# Altium project Nixie Valve Clock.PrjPcb (part 1 of 2)
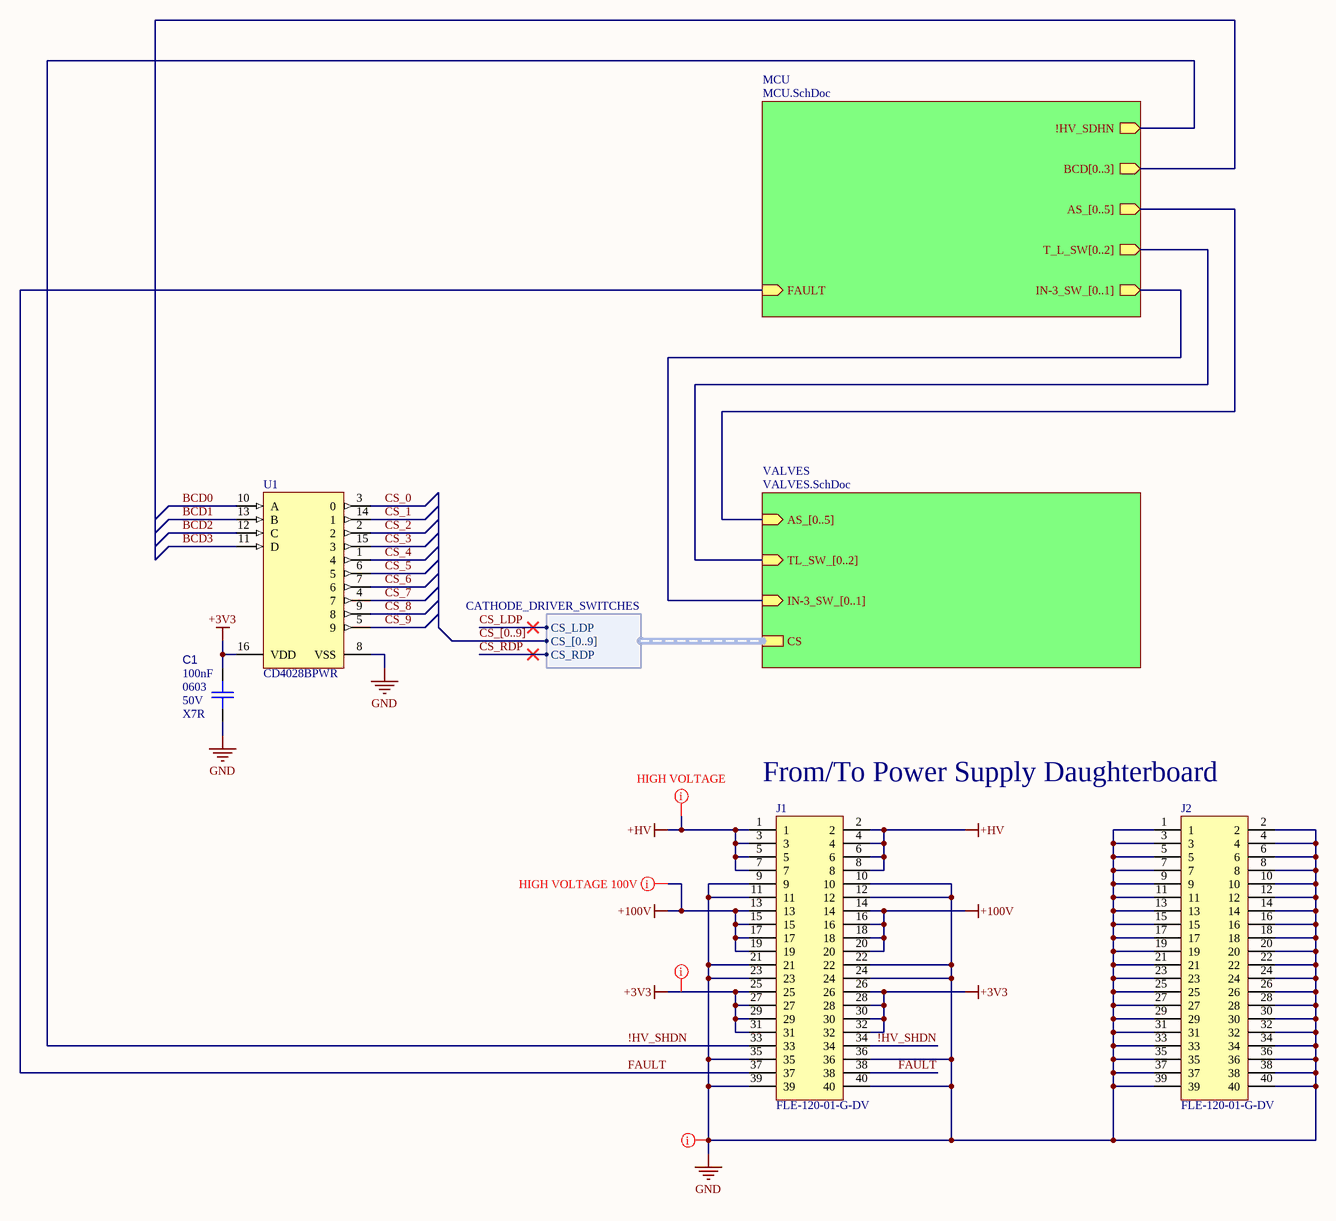
[diagram p0: Nixie Valve Clock.SchDoc]
9 sheets, 163 parts. Net scope: hierarchical (ports join the sheet entries above them; power ports are global).
Board file: Nixie Valve Clock.PcbDoc
Sheets:
  Nixie Valve Clock.SchDoc
    MCU = MCU.SchDoc
    VALVES = VALVES.SchDoc
      IN-14 VALVE ANODE DRIVER0 = IN-14 VALVE ANODE DRIVER.SchDoc
      IN-14 VALVE ANODE DRIVER1 = IN-14 VALVE ANODE DRIVER.SchDoc
      IN-14 VALVE ANODE DRIVER2 = IN-14 VALVE ANODE DRIVER.SchDoc
      IN-14 VALVE ANODE DRIVER3 = IN-14 VALVE ANODE DRIVER.SchDoc
      IN-14 VALVE ANODE DRIVER4 = IN-14 VALVE ANODE DRIVER.SchDoc
      IN-14 VALVE ANODE DRIVER5 = IN-14 VALVE ANODE DRIVER.SchDoc
      IN-14 VALVE CATHODE DRIVER_0 = IN-14 VALVE CATHODE DRIVER.SchDoc
      IN-14 VALVE CATHODE DRIVER_1 = IN-14 VALVE CATHODE DRIVER.SchDoc
      IN-14 VALVE CATHODE DRIVER_2 = IN-14 VALVE CATHODE DRIVER.SchDoc
      IN-14 VALVE CATHODE DRIVER_3 = IN-14 VALVE CATHODE DRIVER.SchDoc
      IN-14 VALVE CATHODE DRIVER_4 = IN-14 VALVE CATHODE DRIVER.SchDoc
      IN-14 VALVE CATHODE DRIVER_5 = IN-14 VALVE CATHODE DRIVER.SchDoc
      IN-14 VALVE CATHODE DRIVER_6 = IN-14 VALVE CATHODE DRIVER.SchDoc
      IN-14 VALVE CATHODE DRIVER_7 = IN-14 VALVE CATHODE DRIVER.SchDoc
      IN-14 VALVE CATHODE DRIVER_8 = IN-14 VALVE CATHODE DRIVER.SchDoc
      IN-14 VALVE CATHODE DRIVER_9 = IN-14 VALVE CATHODE DRIVER.SchDoc
      IN-14_VALVE_x2_0 = IN-14 VALVE x2.SchDoc
        IN-14 VALVE_0 = IN-14 VALVE.SchDoc
        IN-14 VALVE_1 = IN-14 VALVE.SchDoc
      IN-14_VALVE_x2_1 = IN-14 VALVE x2.SchDoc
        IN-14 VALVE_0 = IN-14 VALVE.SchDoc
        IN-14 VALVE_1 = IN-14 VALVE.SchDoc
      IN-14_VALVE_x2_2 = IN-14 VALVE x2.SchDoc
        IN-14 VALVE_0 = IN-14 VALVE.SchDoc
        IN-14 VALVE_1 = IN-14 VALVE.SchDoc
      IN-3 VALVE_0 = IN-3 VALVE.SchDoc
      IN-3 VALVE_1 = IN-3 VALVE.SchDoc
      IN-3 VALVE CATHODE DRIVER0 = IN-3 VALVE CATHODE DRIVER.SchDoc
      IN-3 VALVE CATHODE DRIVER1 = IN-3 VALVE CATHODE DRIVER.SchDoc

## Sheet Nixie Valve Clock.SchDoc
size A3; SheetNumber: 1; SheetTotal: 9

### Parts
(Parts that share a designator on the sheet are numbered #1, #2 ... from top to bottom, then left to right.)
?#1  (no value)
C1  value 100nF  Voltage Rating: 50V  Case/Package: 0603  Dielectric: X7R  [CAPC1608X09N]  (hidden comment: CGA3E2X7R1H104K080AA)
J1  FLE-120-01-G-DV  [FLE-120-01-XX-DV]
J2  FLE-120-01-G-DV  [FLE-120-01-XX-DV]
U1  CD4028BPWR  [PW0016A_N]

### Sub-sheets
MCU = MCU.SchDoc: AS_[0..5] (out), BCD[0..3] (out), T_L_SW[0..2] (out), IN-3_SW_[0..1] (out), !HV_SDHN (out), FAULT (in)
VALVES = VALVES.SchDoc: AS_[0..5] (in), CS (harness CATHODE_DRIVER_SWITCHES), TL_SW_[0..2] (in), IN-3_SW_[0..1] (in)

### Harnesses
CATHODE_DRIVER_SWITCHES: CS_LDP, CS_[0..9], CS_RDP

### Nets
+3V3: C1.1 J1.25 J1.26 J1.27 J1.28 J1.29 J1.30 J1.31 J1.32 U1.16(VDD)
+100V: J1.13 J1.14 J1.15 J1.16 J1.17 J1.18 J1.19 J1.20
+HV: J1.1 J1.2 J1.3 J1.4 J1.5 J1.6 J1.7 J1.8
GND: C1.2 J1.9 J1.10 J1.11 J1.12 J1.21 J1.22 J1.23 J1.24 J1.35 J1.36 J1.39 J1.40 J2.1 J2.2 J2.3 J2.4 J2.5 J2.6 J2.7 J2.8 J2.9 J2.10 J2.11 J2.12 J2.13 J2.14 J2.15 J2.16 J2.17 J2.18 J2.19 J2.20 J2.21 J2.22 J2.23 J2.24 J2.25 J2.26 J2.27 J2.28 J2.29 J2.30 J2.31 J2.32 J2.33 J2.34 J2.35 J2.36 J2.37 J2.38 J2.39 J2.40 U1.8(VSS)
!HV_SHDN: J1.33 J1.34 ; sheet MCU/!HV_SDHN
BCD0: U1.10(A)
BCD1: U1.13(B)
BCD2: U1.12(C)
BCD3: U1.11(D)
CS_0: U1.3(0)
CS_1: U1.14(1)
CS_2: U1.2
CS_3: U1.15(3)
CS_4: U1.1(4)
CS_5: U1.6(5)
CS_6: U1.7(6)
CS_7: U1.4(7)
CS_8: U1.9(8)
CS_9: U1.5(9)
CS_LDP: sheet VALVES/CS.CS_LDP
CS_RDP: sheet VALVES/CS.CS_RDP
FAULT: J1.37 J1.38 ; sheet MCU/FAULT

### Buses and harness runs
bus CS_[0..9]
bus sheet MCU/AS_[0..5] = sheet VALVES/AS_[0..5]
bus sheet MCU/IN-3_SW_[0..1] = sheet VALVES/IN-3_SW_[0..1]
bus sheet MCU/T_L_SW[0..2] = sheet VALVES/TL_SW_[0..2]

### Layout directives
net class HIGH VOLTAGE: +HV
net class HIGH VOLTAGE 100V: +100V
net class POWER: +3V3, GND

### Notes on the sheet
- From/To Power Supply Daughterboard
- Project:
- Designer:
- Sheet
- of
- Filename:

### Library data of the parts
?#1 = CMP-00003-4: The KETS Schematic Sheet Title Block
C1 = CMP-001-00101-1: Ceramic Capacitor, Multilayer, Ceramic, 50V, 10% +Tol, 10% -Tol, X7R, 15% TC, 0.1uF, Surface Mount, 0603; Reference Standard: AEC-Q200; Multilayer: Yes; Tolerance  (fill in as +-): 10%; Mounting Technology: Surface Mount; Max Operating Temperature: 125°C; Min Operating Temperature: -55°C; Tolerance: 10%; Packaging: Tape and Reel; Length: 1.6mm; Package Style: SMTMeter; Width: 0.8mm; Height: 0.8mm; Pins: 2; Reach SVHC Compliant: Yes; RoHS Compliant: Yes; Package Shape: Rectangular; Tolerance (fill in as +-): 10%; Rated DC Voltage (URdc): 50V; JESD-609 Code: e3; Capacitor Type: Ceramic; Termination: Wraparound; Terminal Finish: Nickel; Dielectric Material: Ceramic; Temperature Characteristics Code: X7R
J1 J2 = CMP-073-000000-3: PCB Receptacle, Board-to-Board, Wire-to-Board, 1.27 mm, 2 Rows, 40 Contacts, Surface Mount; Manufacturer Lifecycle Status: PRODUCTION; Pitch: 1.27mm; MF: Samtec; Connector Type: Receptacle, Socket; Number of Contacts: 40; Max Current Rating: 1.75A; Contact Resistance: 15mΩ; Pins: 40; REACH SVHC: No; Price: None; Component Type: Standard; Pin Count: 40; Housing Color: Black; Lead Pitch: 1.27mm; Number of Rows: 2; Max Operating Temperature: 125°C; MP: FLE-120-01-XX-DV; Value: *; Design Item ID: FLE-120-01-XX-DV; Number of Positions: 40; RoHS: Compliant; Lifecycle Status: Production; Source: FLE-120-01-XX-DV.SchLib; Packaging: Bulk; Orientation: Straight; Contact Material: Bronze; Row Spacing: 1.27mm; Housing Material: Polymer; Current Rating: 1.75A; Contact Plating: Gold; Termination: Solder; Length: 25.51mm; Gender: Receptacle; Lead Free: Lead Free; Depth: 3.33mm; Color: Black; Mounting Technology: Surface Mount; Min Operating Temperature: -55°C; Package: None; Radiation Hardening: No; Availability: Unavailable
U1 = CMP-00024-00008-1: CMOS BCD-to-Decimal or Binary-to-Octal Decoders/Drivers 16-TSSOP -55 to 125; Manufacturer Lifecycle Status: ACTIVE; Min Supply Voltage: 3V; Bandwidth: 8MHz; Number of Outputs: 10; Propagation Delay: 160ns; Logic Function: Decoder, Demultiplexer; Number of Elements: 1; Turn-On Delay Time: 350ns; Polarity: Non-Inverting; Max Supply Voltage: 18V; Number of Inputs: 4; Low Level Output Current: 6.8mA; Quiescent Current: 100µA; Supply Type: Dual, Single; Max Operating Temperature: 125°C; Min Operating Temperature: -55°C; Number of Output Lines: 10; Thickness: 1mm; Weight: 61.887009mg; Independent Circuits: 1; Number of Bits: 10; Number of Channels: 1; RoHS Compliant: Yes; Mounting Technology: Surface Mount; Number of Input Lines: 4; Pins: 16; Width: 4.4mm; Lead Free: Lead Free; Case/Package: TSSOP; RoHS: Compliant; Contact Plating: Gold; High Level Output Current: 6.8mA; Length: 5mm; Lifecycle Status: Production; Height: 1.2mm

## Sheet MCU.SchDoc
size A3; SheetNumber: 2; SheetTotal: 9
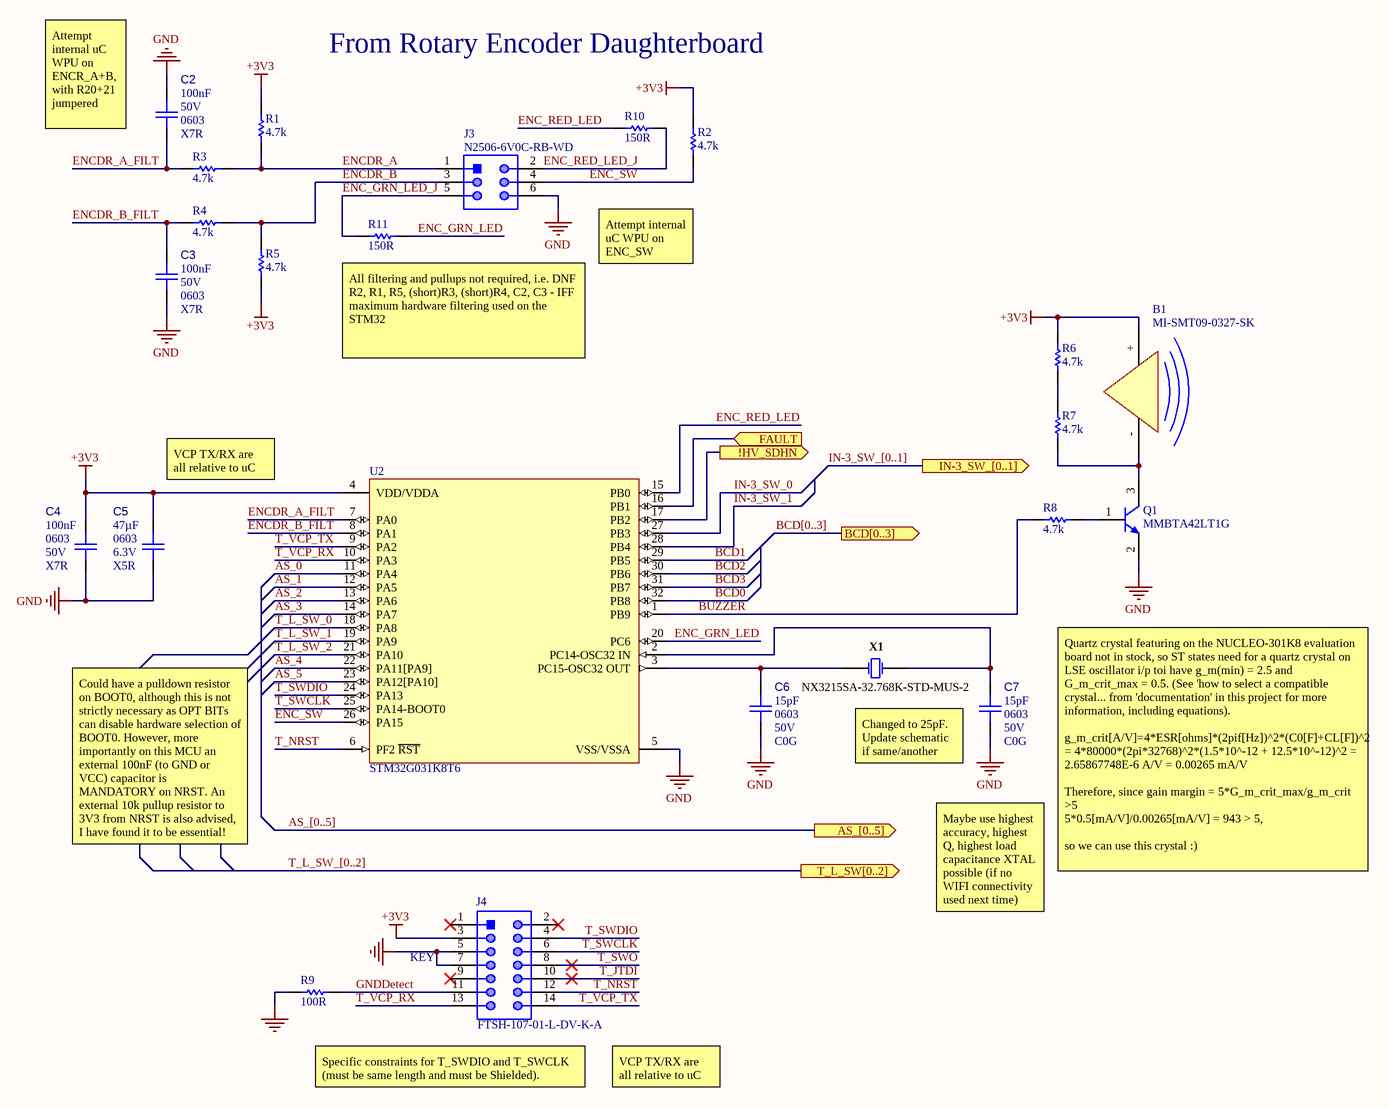
[diagram p1: MCU.SchDoc]

### Parts
(Parts that share a designator on the sheet are numbered #1, #2 ... from top to bottom, then left to right.)
?#2  (no value)
B1  MI-SMT09-0327-SK  [INDP9696X53N]
C2  value 100nF  Voltage Rating: 50V  Case/Package: 0603  Dielectric: X7R  [CAPC1608X09N]  (hidden comment: CGA3E2X7R1H104K080AA)
C3  value 100nF  Voltage Rating: 50V  Case/Package: 0603  Dielectric: X7R  [CAPC1608X09N]  (hidden comment: CGA3E2X7R1H104K080AA)
C4  value 100nF  Voltage Rating: 50V  Case/Package: 0603  Dielectric: X7R  [CAPC1608X09N]  (hidden comment: CGA3E2X7R1H104K080AA)
C5  value 47µF  Dielectric: X5R  Voltage Rating: 6.3V  Case/Package: 0603  [CAPC1608X87X35NL15T15]  (hidden comment: 06036D476MAT2A)
C6  value 15pF  Voltage Rating: 50V  Dielectric: C0G  Case/Package: 0603  [CAPC1608X87X35NL15T15]  (hidden comment: C0603X150J5GACTU)
C7  value 15pF  Voltage Rating: 50V  Dielectric: C0G  Case/Package: 0603  [CAPC1608X87X35NL15T15]  (hidden comment: C0603X150J5GACTU)
J3  N2506-6V0C-RB-WD  [N2506-6V0C-RB-WD-Footprint-1]
J4  FTSH-107-01-L-DV-K-A  [FP-FTSH-107-01-L-DV-K-A-MFG]
Q1  MMBTA42LT1G  [ONSC-SOT-23-3-318-08_V]
R1  value 4.7k  [RESC1608X55X25NL10T15]  (hidden comment: Resistor 4k7 +/-1% 0603 100 mW)
R2  value 4.7k  [RESC1608X55X25NL10T15]  (hidden comment: Resistor 4k7 +/-1% 0603 100 mW)
R3  value 4.7k  [RESC1608X55X25NL10T15]  (hidden comment: Resistor 4k7 +/-1% 0603 100 mW)
R4  value 4.7k  [RESC1608X55X25NL10T15]  (hidden comment: Resistor 4k7 +/-1% 0603 100 mW)
R5  value 4.7k  [RESC1608X55X25NL10T15]  (hidden comment: Resistor 4k7 +/-1% 0603 100 mW)
R6  value 4.7k  [RESC1608X55X25NL10T15]  (hidden comment: Resistor 4k7 +/-1% 0603 100 mW)
R7  value 4.7k  [RESC1608X55X25NL10T15]  (hidden comment: Resistor 4k7 +/-1% 0603 100 mW)
R8  value 4.7k  [RESC1608X55X25NL10T15]  (hidden comment: Resistor 4k7 +/-1% 0603 100 mW)
R9  value 100R  [RESC1608X55X25NL10T15]  (hidden comment: ERJ-3EKF1000V)
R10  value 150R  [RESC1608X55X25NL10T15]  (hidden comment: CRCW0603150RFKEAHP)
R11  value 150R  [RESC1608X55X25NL10T15]  (hidden comment: CRCW0603150RFKEAHP)
U2  STM32G031K8T6  [TQFP80P900X900X160-32N]
X1  NX3215SA-32.768K-STD-MUS-2  [NX3215SA-32.768K-STD-MUS-2-Footprint-1]

### Ports
!HV_SDHN (out), AS_[0..5] (out), BCD[0..3] (out), FAULT (in), IN-3_SW_[0..1] (out), T_L_SW[0..2] (out)

### Nets
+3V3: B1.+(VCC) C4.1 C5.1 J4.3 R1.2 R2.2 R5.1 R6.2 U2.4(VDD/VDDA)
GND: C2.2 C3.1 C4.2 C5.2 C6.2 C7.2 J3.6 J4.5 J4.7 Q1.2(E) R9.1 U2.5(VSS/VSSA)
!HV_SHDN: U2.17(PB2) ; port !HV_SDHN
AS_0: U2.11(PA4)
AS_1: U2.12(PA5)
AS_2: U2.13(PA6)
AS_3: U2.14(PA7)
AS_4: U2.22(PA11[PA9])
AS_5: U2.23(PA12[PA10])
BCD0: U2.32(PB8)
BCD1: U2.29(PB5)
BCD2: U2.30(PB6)
BCD3: U2.31(PB7)
BUZZER: R8.1 U2.1(PB9)
ENC_GRN_LED: R11.2 U2.20(PC6)
ENC_GRN_LED_J: J3.5 R11.1
ENC_RED_LED: R10.2 U2.15(PB0)
ENC_RED_LED_J: J3.2 R10.1
ENC_SW: J3.4 R2.1 U2.26(PA15)
ENCDR_A: J3.1 R1.1 R3.2
ENCDR_A_FILT: C2.1 R3.1 U2.7(PA0)
ENCDR_B: J3.3 R4.2 R5.2
ENCDR_B_FILT: C3.2 R4.1 U2.8(PA1)
FAULT: U2.16(PB1) ; port FAULT
GNDDetect: J4.11 R9.2
IN-3_SW_0: U2.27(PB3)
IN-3_SW_1: U2.28(PB4)
T_JTDI: J4.10
T_L_SW_0: U2.18(PA8)
T_L_SW_1: U2.19(PA9)
T_L_SW_2: U2.21(PA10)
T_NRST: J4.12 U2.6(PF2_~{RST})
T_SWCLK: J4.6 U2.25(PA14-BOOT0)
T_SWDIO: J4.4 U2.24(PA13)
T_SWO: J4.8
T_VCP_RX: J4.13 U2.10(PA3)
T_VCP_TX: J4.14 U2.9(PA2)
NetB1_-: B1.-(GND) Q1.3(C) R7.1
NetC6_1: C6.1 U2.3(PC15-OSC32_OUT) X1.1
NetC7_1: C7.1 U2.2(PC14-OSC32_IN) X1.2
NetQ1_1: Q1.1(B) R8.2
NetR6_1: R6.1 R7.2

Not connected (* = marked no-connect by the designer): J4 1* 2* 9*

### Buses and harness runs
bus AS_[0..5] = port AS_[0..5]
bus BCD[0..3] = port BCD[0..3]
bus IN-3_SW_[0..1] = port IN-3_SW_[0..1]
bus T_L_SW_[0..2] = port T_L_SW[0..2]

### Notes on the sheet
- From Rotary Encoder Daughterboard
- (near C2) Attempt internal uC WPU on ENCR_A+B, with R20+21 jumpered
- Attempt internal uC WPU on ENC_SW
- (near R11) All filtering and pullups not required, i.e. DNF R2, R1, R5, (short)R3, (short)R4, C2, C3 - IFF maximum hardware filtering used on the STM32
- VCP TX/RX are all relative to uC
- Changed to 25pF. Update schematic if same/another 12.5pF load capacitance XTAL is used
- Could have a pulldown resistor on BOOT0, although this is not strictly necessary as OPT BITs can disable hardware selection of BOOT0. However, more importantly on this MCU an external 100nF (to GND or VCC) capacitor is MANDATORY on NRST. An external 10k pullup resistor to 3V3 from NRST is also advised, I have found it to be essential!
- Maybe use highest accuracy, highest Q, highest load capacitance XTAL possible (if no WIFI connectivity used next time)
- Quartz crystal featuring on the NUCLEO-301K8 evaluation board not in stock, so ST states need for a quartz crystal on LSE oscillator i/p toi have g_m(min) = 2.5 and G_m_crit_max = 0.5. (See 'how to select a compatible crystal... from 'documentation' in this project for more information, including equations).
  g_m_crit[A/V]=4*ESR[ohms]*(2pif[Hz])^2*(C0[F]+CL[F])^2 = 4*80000*(2pi*32768)^2*(1.5*10^-12 + 12.5*10^-12)^2 = 2.65867748E-6 A/V = 0.00265 mA/V
  Therefore, since gain margin = 5*G_m_crit_max/g_m_crit >5
  5*0.5[mA/V]/0.00265[mA/V] = 943 > 5,
  so we can use this crystal :)
- (near J4) KEY
- Specific constraints for T_SWDIO and T_SWCLK (must be same length and must be Shielded).
- Project:
- Designer:
- Sheet
- of
- Filename:

### Library data of the parts
?#2 = CMP-00003-4: The KETS Schematic Sheet Title Block
B1 = CMP-00030-00004-2: Magnetic Indicator SMT 9.6MM 3V; RoHS Compliant: Yes; Mounting Technology: SMT; Pins: 2
C2-C4 = CMP-001-00101-1: as C1 on sheet Nixie Valve Clock; Tolerance  (fill in as +-): 10%; Mounting Technology: Surface Mount; Max Operating Temperature: 125°C; Min Operating Temperature: -55°C; Tolerance: 10%; Packaging: Tape and Reel; Length: 1.6mm; Package Style: SMTMeter; Width: 0.8mm; Height: 0.8mm; Pins: 2; Reach SVHC Compliant: Yes; RoHS Compliant: Yes; Package Shape: Rectangular; Tolerance (fill in as +-): 10%; Rated DC Voltage (URdc): 50V; JESD-609 Code: e3; Capacitor Type: Ceramic; Termination: Wraparound; Terminal Finish: Nickel; Dielectric Material: Ceramic; Temperature Characteristics Code: X7R
C5 = CMP-00388-1: 0603 (1608Metric) CERAMIC CAPACITOR ceramic capacitor 6.3V 47uF ±20% X5R; Capacitor Type: MLCC; Number of Terminals: 2; Mounting Technology: Surface Mount; Length: 1.6mm; Tolerance: 20%; Max Operating Temperature: 85°C; Lifecycle Status: Production; Min Operating Temperature: -55°C; Schedule B: 8532240020; Voltage Rating (DC): 6.3V; RoHS Compliant: Yes; Pins: 2; RoHS: Compliant; Height: 1.02mm; Dielectric Material: Ceramic; Width: 800µm; Material: Ceramic; REACH SVHC: Yes
C6 C7 = CMP-00385-1: Cap Ceramic 15pF 50V C0G 5% Pad SMD 0603 Flexible Termination 125C Extreme Low ESR T/R; RoHS Compliant: Yes; Termination: SMD/SMT; Case Code (Imperial): 0603; Features: Soft Termination; Schedule B: 8532240020, 8532240020; Tolerance: 5%; Voltage Rating (DC): 50V; Lifecycle Status: Production; Depth: 800µm; Length: 1.6mm; Height: 800µm; Packaging: Tape & Reel; Case Code (Metric): 1608; China RoHS: Compliant; Thickness: 863.6µm; Pins: 2; Max Operating Temperature: 125°C; Mounting Technology: Surface Mount; Lead Free: Lead Free; Dielectric Material: Ceramic; RoHS: Compliant; Min Operating Temperature: -55°C; Radiation Hardening: No; Number of Terminals: 2; Width: 800µm; REACH SVHC: Yes
J3 = CMP-002-00208-1: 80001386988 N2506-6V0C-Rb-Wd=06//Ht/Vsmt/30U/Rohs/Cap/T&r; Number of Positions: 6; Current Rating: 5A; Pitch: 2.54mm; Connector Type: Male Pin; Insulation Resistance: 1GΩ; Plating Thickness: 762nm; Row Spacing: 6.86mm; Color: Black; Pins: 6; Max Operating Temperature: 105°C; Terminal Pitch: 2.54mm; Number of Rows: 2; Contact Plating: Gold; Mounting Technology: Surface Mount; Min Operating Temperature: -55°C; REACH SVHC: Yes; Contact Mating Length: 6.1722mm; Height: 11.06mm; Contact Gender: Male; Termination: Solder; Contact Material: Gold, Tin; Lifecycle Status: Production; RoHS: Compliant; Number of Contacts: 6
J4 = CMP-002-00203-1: Conn Unshrouded Header HDR 14 POS 1.27mm Solder ST Top Entry SMD TIGER CLAW™ Tube; Manufacturer Lifecycle Status: PRODUCTION; Current Rating: 3.4A; Gender: Male; Number of Contacts: 14; Contact Plating: Gold; Pitch: 1.27mm; Termination: Solder; Orientation: Vertical; Lifecycle Status: Production; Number of Rows: 2; Max Operating Temperature: 125°C; Pins: 14; Height: 6.38mm; Schedule B: 8536694040; Contact Material: Gold, Nickel; Lead Free: Lead Free; Min Operating Temperature: -55°C; RoHS: Compliant
Q1 = CMP-013-00062-1: Bipolar (BJT) Single Transistor, General Purpose, NPN, 300 V, 500 mA, 225 mW, SOT-23, Surface Mount; Manufacturer Lifecycle Status: ACTIVE; Frequency: 50MHz; Max Collector Current: 500mA; Collector Emitter Breakdown Voltage: 300V; Emitter Base Voltage (VEBO): 6V; Collector Emitter Saturation Voltage: 500mV; Number of Elements: 1; Max Power Dissipation: 300mW; hFE Min: 40; Clock Frequency: 50MHz; Element Configuration: Single; Packaging: Tape and Reel; Lead Free: Lead Free; RoHS: Compliant; Number of Terminals: 3; Lifecycle Status: Production; Current Rating: 500mA; Polarity: NPN; Width: 1.397mm; Case/Package: SOT-23-3; Max Operating Temperature: 150°C; China RoHS: Compliant; Height: 1.016mm; Weight: 4.535924g; Gain Bandwidth Product: 50MHz; Contact Plating: Tin; Schedule B: 8541210080, 8541210080; Pins: 3; Transition Frequency: 50MHz; Voltage Rating (DC): 300V; REACH SVHC: Yes; Collector Emitter Voltage (VCEO): 300V; Min Operating Temperature: -55°C; Collector Base Voltage (VCBO): 300V; Length: 3.0226mm; Max Breakdown Voltage: 300V; Radiation Hardening: No
R1-R8 = CMP-009-00031-13: Chip Resistor, 4.7 KOhm, +/- 1%, 0.1 W, -55 to 155 degC, 0603 (1608 Metric); Power: 100mW; RoHS Compliant: True; Min Operating Temperature: -55°C; Tolerance: 1%; Mounting Technology: SM; Max Operating Temperature: 155°C; Pins: 2; Case/Package: 0603
R9 = CMP-00265-1: Fixed Resistor, Metal Glaze/thick Film, 0.1W, 100ohm, 75V, 1% +/-Tol, 100ppm/Cel, Surface Mount, 0603; Package Length: 1.6mm; Package Height: 0.45mm; Power: 100mW; Temperature Coefficient (ppm/Cel): 100; Package Width: 0.8mm; Reference Standard: AEC-Q200; Rated Temperature: 70°C; Mounting Technology: Surface Mount; Pins: 2; Packaging: Tape and Reel; Case/Package: 0603; Technology: METAL GLAZE/THICK FILM; Voltage Rating: 75V; RoHS Compliant: Yes; Construction: Rectangular; Max Operating Temperature: 155°C; JESD-609 Code: e3; Tolerance: 1%; Reach SVHC Compliant: Yes; Package Shape: Rectangular; Resistor Type: FIXED RESISTOR; Terminal Finish: Nickel; Termination: Wraparound; Working Voltage: 75V; Min Operating Temperature: -55°C
R10 R11 = CMP-00382-2: Res Thick Film 0603 150 Ohm 1% 1/3W ±100ppm/°C Molded SMD SMD Paper T/R; Voltage Rating: 75V; Power Rating: 330mW; Max Power Dissipation: 250mW; Power: 100mW; Case Code (Metric): 1608; Pins: 2; Lifecycle Status: Production; Radiation Hardening: No; Tolerance: 1%; Packaging: Cut Tape; RoHS: Compliant; Features: Automotive AEC-Q200; Case/Package: 0603; Number of Terminations: 2; Lead Free: Lead Free; RoHS Compliant: Yes; Depth: 850µm; Height: 450µm; Min Operating Temperature: -55°C; Max Operating Temperature: 155°C; Length: 1.55mm; China RoHS: Non-Compliant; Temperature Coefficient: 100ppm/°C; Schedule B: 8533210045, 8533210045; Composition: Thick Film; Working Voltage: 75V; Weight: 2.012816mg; Military Standard: Not; Mounting Technology: Surface Mount; Voltage Rating (DC): 75V; Number of Terminals: 2; Termination: SMD/SMT; Case Code (Imperial): 0603; Contact Plating: Tin; Width: 850µm; Power Dissipation: 330mW; REACH SVHC: Yes
U2 = CMP-00383-2: RISC Microcontroller, 32-Bit, FLASH, CORTEX-M0 CPU, 64MHz, CMOS, PQFP32; Supply Voltage Max: 3.6V; Min Supply Voltage: 1.7V; Flash Memory Size: 64kB; EEPROM Memory Size: 0B; Number of A/D Converters: 1; Clock Frequency: 48MHz; Number of USART Channels: 2; Data Memory: 8K; Program Memory: 64K; Peripherals: POR; RAM Size: 8kB; Number of I/Os: 3; Operating Supply Voltage: 1.8V; ADC Channels (Resolution): 16-Ch 12-Bit; Number of Timers/Counters: 9; Number of PWM Channels: 17; Max Junction Temperature (Tj): 105°C; Data Bus Width: 32b; Register Bit Depth: 32; Max Supply Current: 6.9mA; Core Architecture: ARM Cortex-M0+; Interface: I2C, I2S, IrDA, LIN, SMBus, SPI, UART, USART; Number of ADC Channels: 16; Terminal Pitch: 800µm; Length: 7mm; REACH SVHC: Yes; China RoHS: Compliant; Number of SPI Channels: 2; Height - Seated (Max): 1.6mm; Number of Terminals: 32; Width: 7mm; Number of UART Channels: 3; Number of I2C Channels: 2; Maximum Clock Frequency: 64MHz; Ambient Temperature Range High: 85°C; Frequency: 64MHz; Height: 1.6mm; Pins: 32; Supply Voltage Min: 1.7V; Memory Format: FLASH; Lifecycle Status: Production; Max Supply Voltage: 3.6V; Memory Size: 64kB; Schedule B: 8542310000; Min Operating Temperature: -40°C; Max Operating Temperature: 85°C; RoHS: Compliant
X1 = CMP-003-00032-2: Crystal 0.032768MHz ±20ppm (Tol) 12.5pF FUND 80000Ohm Automotive AEC-Q200 2-Pin SMD; ESR (Equivalent Series Resistance): 80kΩ; ESR: 80k; Frequency Tolerance: 0.002%; Frequency: 32.768kHz; Frequency Stability: 400ppm; Min Operating Temperature: -40°C; Lifecycle Status: Production; Schedule B: 8541600080; RoHS: Compliant; Width: 1.4986mm; REACH SVHC: Yes; Length: 3.2004mm; Mounting Technology: Surface Mount; Max Operating Temperature: 125°C; Tolerance: 0.002%; Case/Package: SMD/SMT; Pins: 2; Load Capacitance: 12.5pF; Packaging: Tape & Reel (TR); RoHS Compliant: Yes; Height: 900µm

## Sheet VALVES.SchDoc
size A3; SheetNumber: 3; SheetTotal: 9
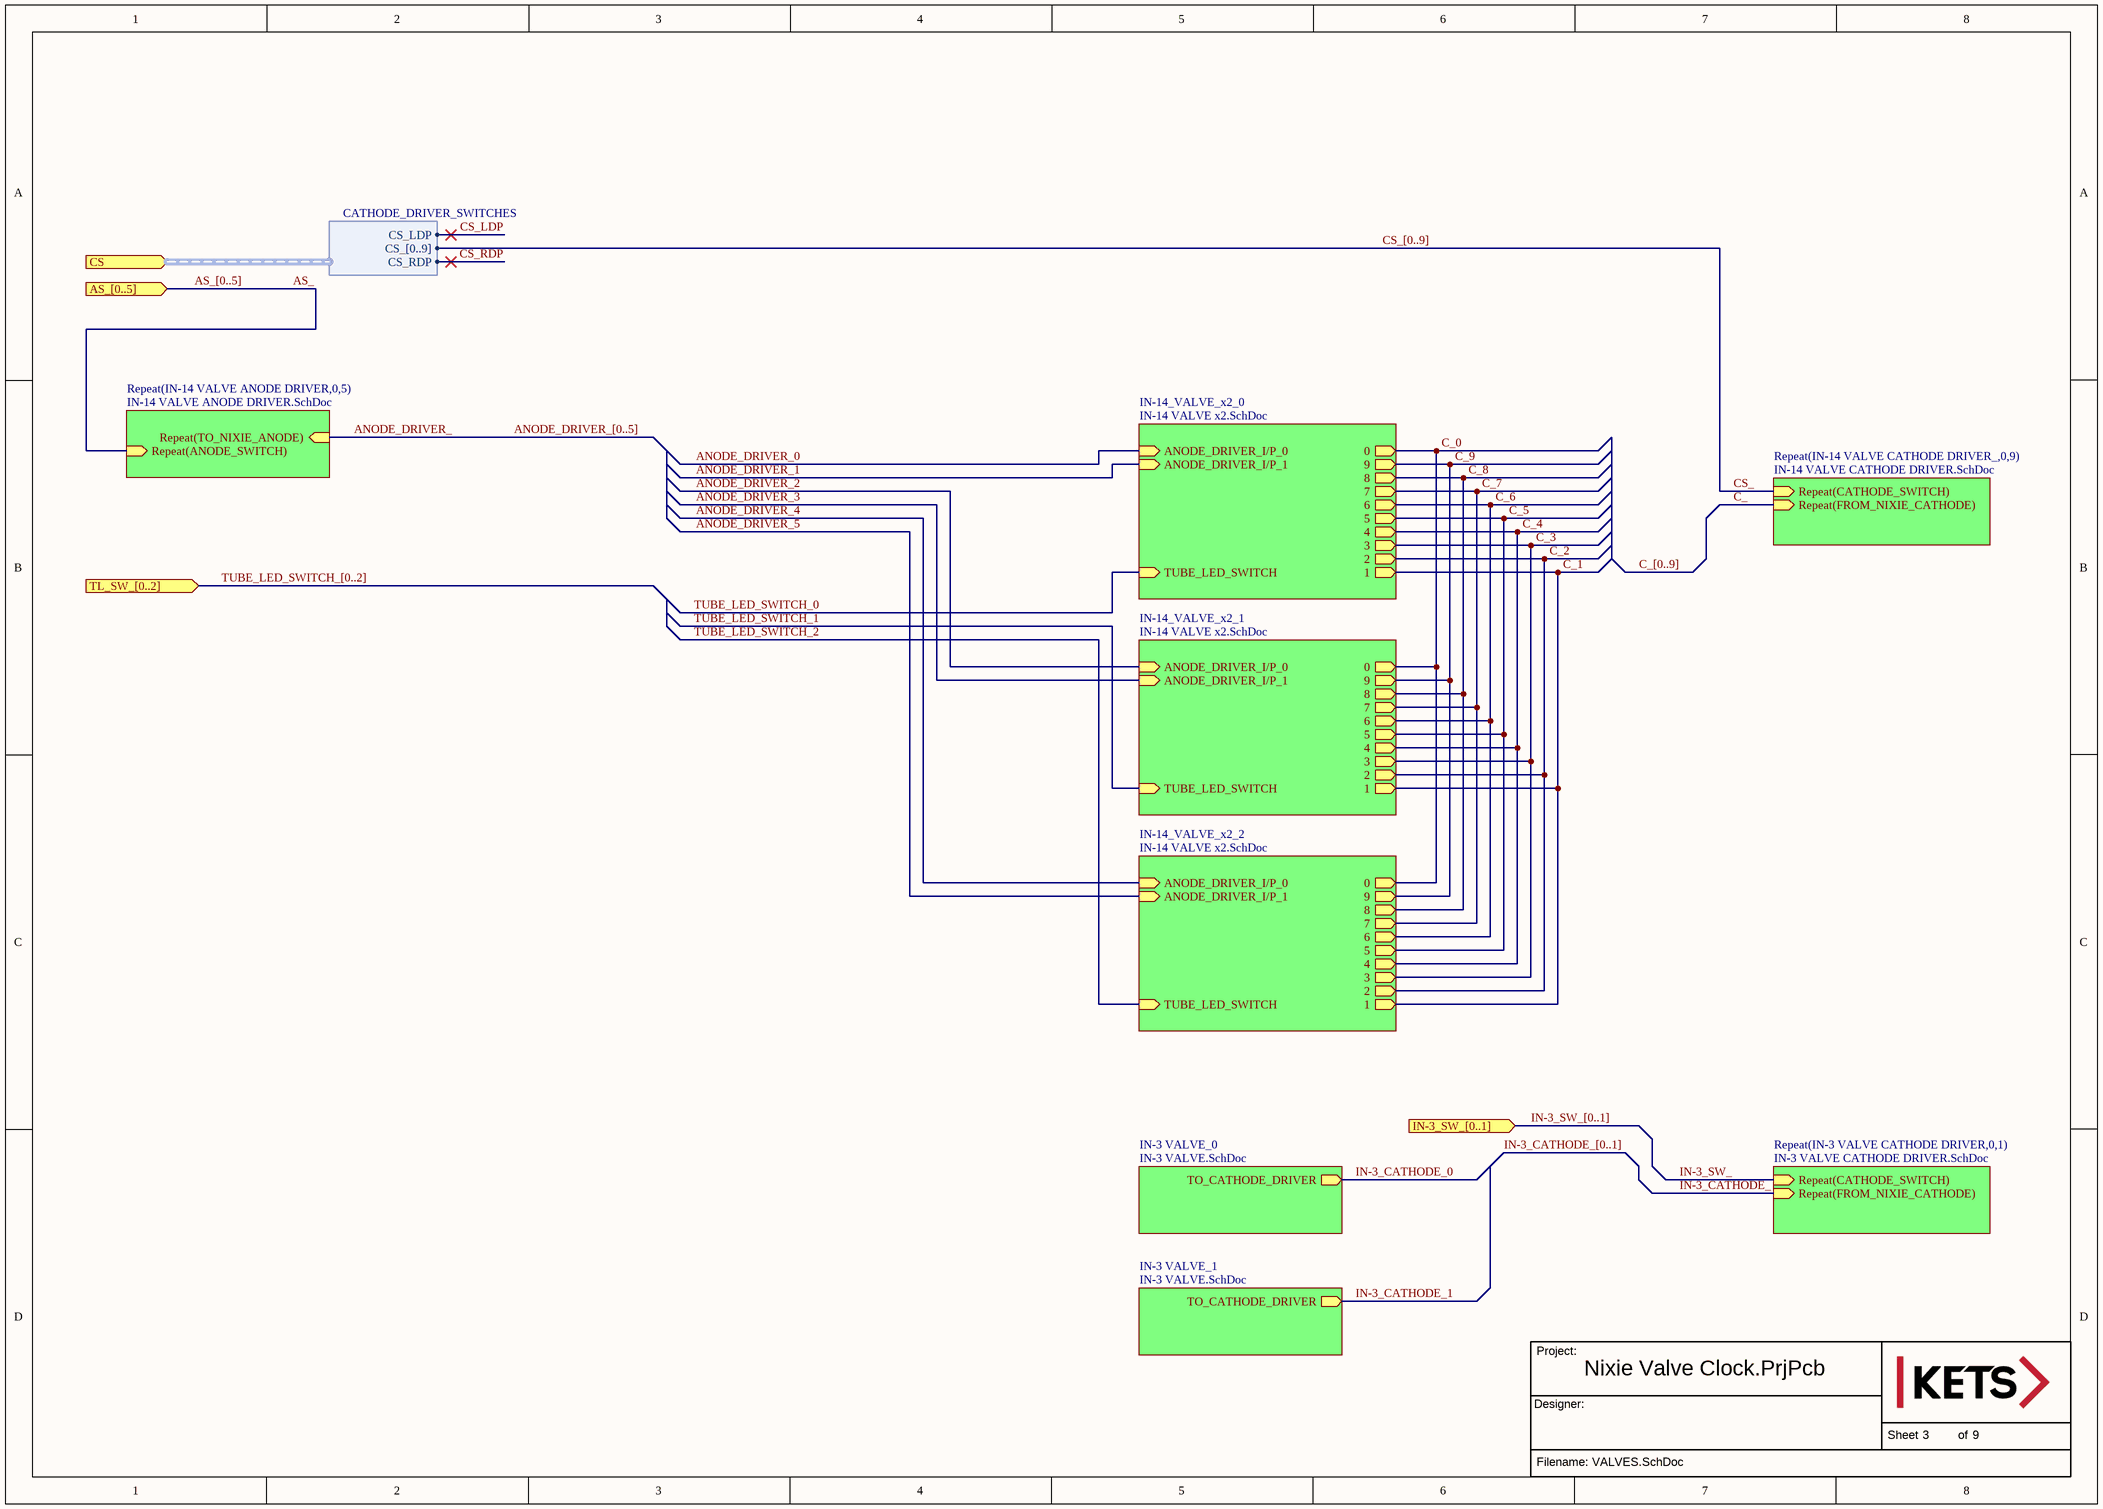
[diagram p2: VALVES.SchDoc]

### Parts
(Parts that share a designator on the sheet are numbered #1, #2 ... from top to bottom, then left to right.)
?#3  (no value)

### Sub-sheets
IN-3 VALVE_0 = IN-3 VALVE.SchDoc: TO_CATHODE_DRIVER (out)
IN-3 VALVE_1 = IN-3 VALVE.SchDoc: TO_CATHODE_DRIVER (out)
IN-14_VALVE_x2_0 = IN-14 VALVE x2.SchDoc: ANODE_DRIVER_I/P_0 (in), ANODE_DRIVER_I/P_1 (in), TUBE_LED_SWITCH (in), 0 (out), 9 (out), 8 (out), 7 (out), 6 (out), 5 (out), 4 (out), 3 (out), 2 (out), 1 (out)
IN-14_VALVE_x2_1 = IN-14 VALVE x2.SchDoc: ANODE_DRIVER_I/P_0 (in), ANODE_DRIVER_I/P_1 (in), TUBE_LED_SWITCH (in), 0 (out), 9 (out), 8 (out), 7 (out), 6 (out), 5 (out), 4 (out), 3 (out), 2 (out), 1 (out)
IN-14_VALVE_x2_2 = IN-14 VALVE x2.SchDoc: ANODE_DRIVER_I/P_0 (in), ANODE_DRIVER_I/P_1 (in), TUBE_LED_SWITCH (in), 0 (out), 9 (out), 8 (out), 7 (out), 6 (out), 5 (out), 4 (out), 3 (out), 2 (out), 1 (out)
Repeat(IN-3 VALVE CATHODE DRIVER,0,1) = IN-3 VALVE CATHODE DRIVER.SchDoc: Repeat(CATHODE_SWITCH) (in), Repeat(FROM_NIXIE_CATHODE) (in)
Repeat(IN-14 VALVE ANODE DRIVER,0,5) = IN-14 VALVE ANODE DRIVER.SchDoc: Repeat(ANODE_SWITCH) (in), Repeat(TO_NIXIE_ANODE) (in)
Repeat(IN-14 VALVE CATHODE DRIVER_,0,9) = IN-14 VALVE CATHODE DRIVER.SchDoc: Repeat(CATHODE_SWITCH) (in), Repeat(FROM_NIXIE_CATHODE) (in)

### Ports
AS_[0..5] (in), CS (in, harness CATHODE_DRIVER_SWITCHES), IN-3_SW_[0..1] (in), TL_SW_[0..2] (in)

### Harnesses
CATHODE_DRIVER_SWITCHES: CS_LDP, CS_[0..9], CS_RDP

### Nets
ANODE_DRIVER_: sheet Repeat(IN-14 VALVE ANODE DRIVER,0,5)/Repeat(TO_NIXIE_ANODE)
AS_: sheet Repeat(IN-14 VALVE ANODE DRIVER,0,5)/Repeat(ANODE_SWITCH)
C_: sheet Repeat(IN-14 VALVE CATHODE DRIVER_,0,9)/Repeat(FROM_NIXIE_CATHODE)
C_0: sheet IN-14_VALVE_x2_0/0, sheet IN-14_VALVE_x2_1/0, sheet IN-14_VALVE_x2_2/0
C_1: sheet IN-14_VALVE_x2_0/1, sheet IN-14_VALVE_x2_1/1, sheet IN-14_VALVE_x2_2/1
C_2: sheet IN-14_VALVE_x2_0/2, sheet IN-14_VALVE_x2_1/2, sheet IN-14_VALVE_x2_2/2
C_3: sheet IN-14_VALVE_x2_0/3, sheet IN-14_VALVE_x2_1/3, sheet IN-14_VALVE_x2_2/3
C_4: sheet IN-14_VALVE_x2_0/4, sheet IN-14_VALVE_x2_1/4, sheet IN-14_VALVE_x2_2/4
C_5: sheet IN-14_VALVE_x2_0/5, sheet IN-14_VALVE_x2_1/5, sheet IN-14_VALVE_x2_2/5
C_6: sheet IN-14_VALVE_x2_0/6, sheet IN-14_VALVE_x2_1/6, sheet IN-14_VALVE_x2_2/6
C_7: sheet IN-14_VALVE_x2_0/7, sheet IN-14_VALVE_x2_1/7, sheet IN-14_VALVE_x2_2/7
C_8: sheet IN-14_VALVE_x2_0/8, sheet IN-14_VALVE_x2_1/8, sheet IN-14_VALVE_x2_2/8
C_9: sheet IN-14_VALVE_x2_0/9, sheet IN-14_VALVE_x2_1/9, sheet IN-14_VALVE_x2_2/9
CS_: sheet Repeat(IN-14 VALVE CATHODE DRIVER_,0,9)/Repeat(CATHODE_SWITCH)
CS_LDP: port CS.CS_LDP
CS_RDP: port CS.CS_RDP
IN-3_CATHODE_: sheet Repeat(IN-3 VALVE CATHODE DRIVER,0,1)/Repeat(FROM_NIXIE_CATHODE)
IN-3_SW_: sheet Repeat(IN-3 VALVE CATHODE DRIVER,0,1)/Repeat(CATHODE_SWITCH)

### Buses and harness runs
bus ANODE_DRIVER_[0..5]
bus AS_[0..5] = port AS_[0..5]
bus C_[0..9]
bus CS_[0..9]
bus IN-3_CATHODE_[0..1]
bus IN-3_SW_[0..1] = port IN-3_SW_[0..1]
bus TUBE_LED_SWITCH_[0..2] = port TL_SW_[0..2]

### Notes on the sheet
- Project:
- Designer:
- Sheet
- of
- Filename:

### Library data of the parts
?#3 = CMP-00003-4: The KETS Schematic Sheet Title Block

## Sheet IN-14 VALVE ANODE DRIVER.SchDoc
size A4; SheetNumber: 6; SheetTotal: 9
Used 6 times, as channels VALVES/IN-14 VALVE ANODE DRIVER0, VALVES/IN-14 VALVE ANODE DRIVER1, VALVES/IN-14 VALVE ANODE DRIVER2, VALVES/IN-14 VALVE ANODE DRIVER3, VALVES/IN-14 VALVE ANODE DRIVER4, VALVES/IN-14 VALVE ANODE DRIVER5. Parts and nets are listed once, with the designators drawn on the sheet.
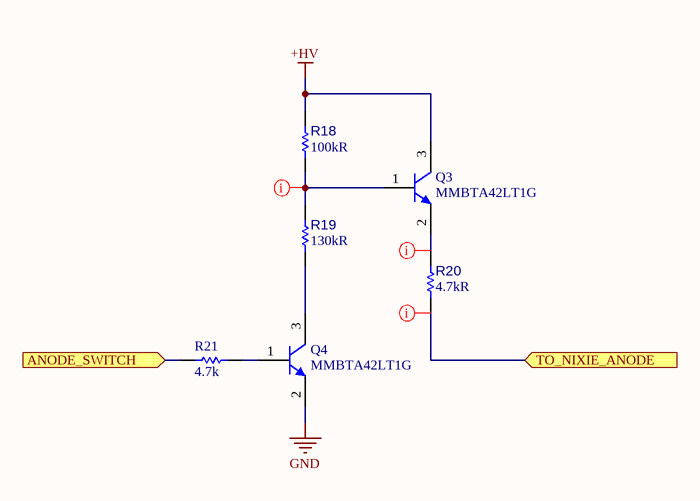
[diagram p3: IN-14 VALVE ANODE DRIVER.SchDoc]

### Parts
?  (no value)
Q3  MMBTA42LT1G  [ONSC-SOT-23-3-318-08_V]
Q4  MMBTA42LT1G  [ONSC-SOT-23-3-318-08_V]
R18  value 100kR  [RESC3126X65X50NL10T20]  (hidden comment: CRGCQ1210F100K)
R19  value 130kR  [RESC3126X65X50NL10T20]  (hidden comment: ERJP14F1303U)
R20  value 4.7kR  [RESC3126X65X50NL10T20]  (hidden comment: CRGCQ1210F4K7)
R21  value 4.7k  [RESC1608X55X25NL10T15]  (hidden comment: Resistor 4k7 +/-1% 0603 100 mW)

### Ports
ANODE_SWITCH (in), TO_NIXIE_ANODE (in)

### Nets
+HV: Q3.3(C) R18.2
GND: Q4.2(E)
ANODE_SWITCH: R21.1 ; port ANODE_SWITCH
TO_NIXIE_ANODE: R20.1 ; port TO_NIXIE_ANODE
NetQ3_1: Q3.1(B) R18.1 R19.2
NetQ3_2: Q3.2(E) R20.2
NetQ4_1: Q4.1(B) R21.2
NetQ4_3: Q4.3(C) R19.1

### Channels
VALVES/IN-14 VALVE ANODE DRIVER0: designators end in A; ports ANODE_SWITCH=AS_0 TO_NIXIE_ANODE=ANODE_DRIVER_0
VALVES/IN-14 VALVE ANODE DRIVER1: designators end in B; ports ANODE_SWITCH=AS_1 TO_NIXIE_ANODE=ANODE_DRIVER_1
VALVES/IN-14 VALVE ANODE DRIVER2: designators end in C; ports ANODE_SWITCH=AS_2 TO_NIXIE_ANODE=ANODE_DRIVER_2
VALVES/IN-14 VALVE ANODE DRIVER3: designators end in D; ports ANODE_SWITCH=AS_3 TO_NIXIE_ANODE=ANODE_DRIVER_3
VALVES/IN-14 VALVE ANODE DRIVER4: designators end in E; ports ANODE_SWITCH=AS_4 TO_NIXIE_ANODE=ANODE_DRIVER_4
VALVES/IN-14 VALVE ANODE DRIVER5: designators end in F; ports ANODE_SWITCH=AS_5 TO_NIXIE_ANODE=ANODE_DRIVER_5

### Layout directives
net class HIGH VOLTAGE: ANODE_DRIVER_0, NetQ3A_1, NetQ3A_2

### Notes on the sheet
- Project:
- Designer:
- Sheet
- of
- Filename:

### Library data of the parts
? = CMP-00003-4: The KETS Schematic Sheet Title Block
Q3 Q4 = CMP-013-00062-1: as Q1 on sheet MCU; Clock Frequency: 50MHz; Element Configuration: Single; Packaging: Tape and Reel; Lead Free: Lead Free; RoHS: Compliant; Number of Terminals: 3; Lifecycle Status: Production; Current Rating: 500mA; Polarity: NPN; Width: 1.397mm; Case/Package: SOT-23-3; Max Operating Temperature: 150°C; China RoHS: Compliant; Height: 1.016mm; Weight: 4.535924g; Gain Bandwidth Product: 50MHz; Contact Plating: Tin; Schedule B: 8541210080, 8541210080; Pins: 3; Transition Frequency: 50MHz; Voltage Rating (DC): 300V; REACH SVHC: Yes; Collector Emitter Voltage (VCEO): 300V; Min Operating Temperature: -55°C; Collector Base Voltage (VCBO): 300V; Length: 3.0226mm; Max Breakdown Voltage: 300V; Radiation Hardening: No
R18 = CMP-00394-2: Res Thick Film 1210 100K Ohm 1% 0.5W(1/2W) ±100ppm/C Pad SMD Automotive T/R; Manufacturer Lifecycle Status: ACTIVE; Working Voltage: 200V; Power: 500mW; Temperature Coefficient: 100ppm/°C; Ambient Temperature Range High: 70°C; Number of Terminals: 2; Height: 550µm; Operating Supply Voltage: 200V; Max Operating Temperature: 155°C; RoHS: Compliant; Lifecycle Status: Production; Mounting Technology: Surface Mount; Composition: Thick Film; Min Operating Temperature: -55°C; Case/Package: 1210; China RoHS: Non-Compliant; Power Dissipation: 500mW; REACH SVHC: Yes; Width: 2.6mm; Voltage Rating (DC): 200V; Power Rating: 500mW; Schedule B: 8533210025, 8533210025; Tolerance: 1%; Pins: 2; Voltage Rating: 200V; Packaging: Cut Tape
R19 = CMP-00392-1: Res Thick Film 1210 130K Ohm 1% 0.5W ±100ppm/°C Molded SMD Embossed Carrier T/R; Manufacturer Lifecycle Status: ACTIVE; Part Series: Anti-Surge High Power Thick Film Chip Resistors; Power Rating: 500mW; Working Voltage: 200V; Min Operating Temperature: -55°C; Case Code (Imperial): 1210; REACH SVHC: Yes; Number of Terminals: 2; Case/Package: 1210; Packaging: Cut Tape; Width: 2.5mm; Composition: Thick Film; Tolerance: 1%; Power: 500mW; Lifecycle Status: Production; Voltage Rating: 200V; Power Dissipation: 500mW; Mounting Technology: Surface Mount; Height: 600µm; Max Operating Temperature: 155°C; RoHS: Compliant; Case Code (Metric): 3225; Length: 3.2mm; Depth: 2.5mm; Voltage Rating (DC): 200V; Termination: Flat; Pins: 2; Temperature Coefficient: 100ppm/°C; Contact Plating: Tin
R20 = CMP-00386-2: Res Thick Film 1210 4.7K Ohm 1% 0.5W(1/2W) ±100ppm/C Pad SMD T/R Automotive AEC-Q200; Manufacturer Lifecycle Status: ACTIVE; Voltage Rating (DC): 200V; Temperature Coefficient: 100ppm/°C; Power Dissipation: 500mW; China RoHS: Non-Compliant; Pins: 2; Width: 2.6mm; REACH SVHC: Yes; Height: 550µm; RoHS: Compliant; Mounting Technology: Surface Mount; Tolerance: 1%; Case/Package: 1210; Schedule B: 8533210025, 8533210025; Ambient Temperature Range High: 70°C; Min Operating Temperature: -55°C; Lifecycle Status: Production; Operating Supply Voltage: 200V; Working Voltage: 200V; Max Operating Temperature: 155°C; Composition: Thick Film; Power: 500mW; Power Rating: 500mW; Voltage Rating: 200V; Packaging: Cut Tape; Number of Terminals: 2
R21 = CMP-009-00031-13: as R1 on sheet MCU; RoHS Compliant: True; Min Operating Temperature: -55°C; Tolerance: 1%; Mounting Technology: SM; Max Operating Temperature: 155°C; Pins: 2; Case/Package: 0603

## Sheet IN-14 VALVE CATHODE DRIVER.SchDoc
size A4; SheetNumber: 7; SheetTotal: 9
Used 10 times, as channels VALVES/IN-14 VALVE CATHODE DRIVER_0, VALVES/IN-14 VALVE CATHODE DRIVER_1, VALVES/IN-14 VALVE CATHODE DRIVER_2, VALVES/IN-14 VALVE CATHODE DRIVER_3, VALVES/IN-14 VALVE CATHODE DRIVER_4, VALVES/IN-14 VALVE CATHODE DRIVER_5, VALVES/IN-14 VALVE CATHODE DRIVER_6, VALVES/IN-14 VALVE CATHODE DRIVER_7, VALVES/IN-14 VALVE CATHODE DRIVER_8, VALVES/IN-14 VALVE CATHODE DRIVER_9. Parts and nets are listed once, with the designators drawn on the sheet.
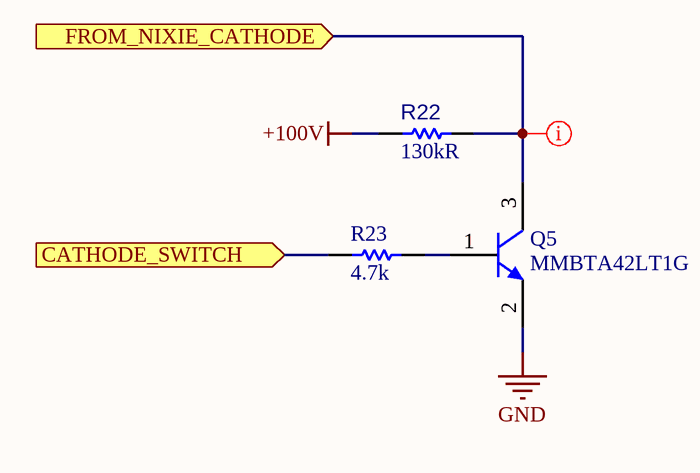
[diagram p4: IN-14 VALVE CATHODE DRIVER.SchDoc]

### Parts
?  (no value)
Q5  MMBTA42LT1G  [ONSC-SOT-23-3-318-08_V]
R22  value 130kR  [RESC3126X65X50NL10T20]  (hidden comment: ERJP14F1303U)
R23  value 4.7k  [RESC1608X55X25NL10T15]  (hidden comment: Resistor 4k7 +/-1% 0603 100 mW)

### Ports
CATHODE_SWITCH (in), FROM_NIXIE_CATHODE (in)

### Nets
+100V: R22.2
GND: Q5.2(E)
CATHODE_SWITCH: R23.1 ; port CATHODE_SWITCH
FROM_NIXIE_CATHODE: Q5.3(C) R22.1 ; port FROM_NIXIE_CATHODE
NetQ5_1: Q5.1(B) R23.2

### Channels
VALVES/IN-14 VALVE CATHODE DRIVER_0: designators end in A; ports CATHODE_SWITCH=CS_0 FROM_NIXIE_CATHODE=C_0
VALVES/IN-14 VALVE CATHODE DRIVER_1: designators end in B; ports CATHODE_SWITCH=CS_1 FROM_NIXIE_CATHODE=C_1
VALVES/IN-14 VALVE CATHODE DRIVER_2: designators end in C; ports CATHODE_SWITCH=CS_2 FROM_NIXIE_CATHODE=C_2
VALVES/IN-14 VALVE CATHODE DRIVER_3: designators end in D; ports CATHODE_SWITCH=CS_3 FROM_NIXIE_CATHODE=C_3
VALVES/IN-14 VALVE CATHODE DRIVER_4: designators end in E; ports CATHODE_SWITCH=CS_4 FROM_NIXIE_CATHODE=C_4
VALVES/IN-14 VALVE CATHODE DRIVER_5: designators end in F; ports CATHODE_SWITCH=CS_5 FROM_NIXIE_CATHODE=C_5
VALVES/IN-14 VALVE CATHODE DRIVER_6: designators end in G; ports CATHODE_SWITCH=CS_6 FROM_NIXIE_CATHODE=C_6
VALVES/IN-14 VALVE CATHODE DRIVER_7: designators end in H; ports CATHODE_SWITCH=CS_7 FROM_NIXIE_CATHODE=C_7
VALVES/IN-14 VALVE CATHODE DRIVER_8: designators end in I; ports CATHODE_SWITCH=CS_8 FROM_NIXIE_CATHODE=C_8
VALVES/IN-14 VALVE CATHODE DRIVER_9: designators end in J; ports CATHODE_SWITCH=CS_9 FROM_NIXIE_CATHODE=C_9

### Layout directives
net class HIGH VOLTAGE 100V: C_0

### Notes on the sheet
- Project:
- Designer:
- Sheet
- of
- Filename:

### Library data of the parts
? = CMP-00003-4: The KETS Schematic Sheet Title Block
Q5 = CMP-013-00062-1: as Q1 on sheet MCU; Clock Frequency: 50MHz; Element Configuration: Single; Packaging: Tape and Reel; Lead Free: Lead Free; RoHS: Compliant; Number of Terminals: 3; Lifecycle Status: Production; Current Rating: 500mA; Polarity: NPN; Width: 1.397mm; Case/Package: SOT-23-3; Max Operating Temperature: 150°C; China RoHS: Compliant; Height: 1.016mm; Weight: 4.535924g; Gain Bandwidth Product: 50MHz; Contact Plating: Tin; Schedule B: 8541210080, 8541210080; Pins: 3; Transition Frequency: 50MHz; Voltage Rating (DC): 300V; REACH SVHC: Yes; Collector Emitter Voltage (VCEO): 300V; Min Operating Temperature: -55°C; Collector Base Voltage (VCBO): 300V; Length: 3.0226mm; Max Breakdown Voltage: 300V; Radiation Hardening: No
R22 = CMP-00392-1: as R19 on sheet IN-14 VALVE ANODE DRIVER; Min Operating Temperature: -55°C; Case Code (Imperial): 1210; REACH SVHC: Yes; Number of Terminals: 2; Case/Package: 1210; Packaging: Cut Tape; Width: 2.5mm; Composition: Thick Film; Tolerance: 1%; Power: 500mW; Lifecycle Status: Production; Voltage Rating: 200V; Power Dissipation: 500mW; Mounting Technology: Surface Mount; Height: 600µm; Max Operating Temperature: 155°C; RoHS: Compliant; Case Code (Metric): 3225; Length: 3.2mm; Depth: 2.5mm; Voltage Rating (DC): 200V; Termination: Flat; Pins: 2; Temperature Coefficient: 100ppm/°C; Contact Plating: Tin
R23 = CMP-009-00031-13: as R1 on sheet MCU; RoHS Compliant: True; Min Operating Temperature: -55°C; Tolerance: 1%; Mounting Technology: SM; Max Operating Temperature: 155°C; Pins: 2; Case/Package: 0603

## Sheet IN-14 VALVE x2.SchDoc
size A4; SheetNumber: 4; SheetTotal: 9
Used 3 times, as channels VALVES/IN-14_VALVE_x2_0, VALVES/IN-14_VALVE_x2_1, VALVES/IN-14_VALVE_x2_2. Parts and nets are listed once, with the designators drawn on the sheet.
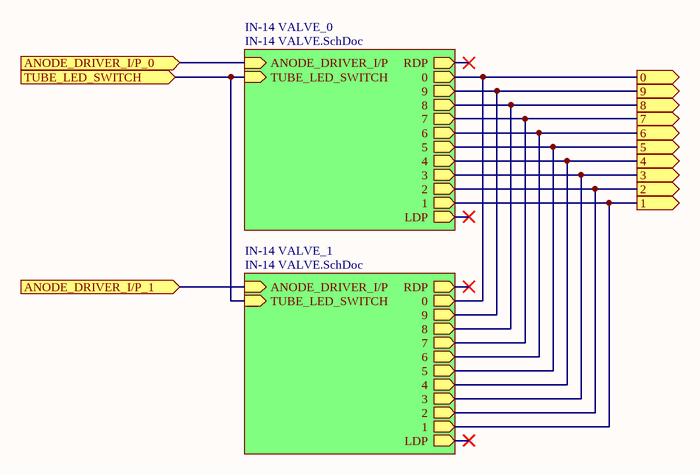
[diagram p5: IN-14 VALVE x2.SchDoc]

### Parts
?  (no value)

### Sub-sheets
IN-14 VALVE_0 = IN-14 VALVE.SchDoc: ANODE_DRIVER_I/P (in), RDP (out), 0 (out), 9 (out), 8 (out), 7 (out), 6 (out), 5 (out), 4 (out), 3 (out), 2 (out), 1 (out), LDP (out), TUBE_LED_SWITCH (in)
IN-14 VALVE_1 = IN-14 VALVE.SchDoc: ANODE_DRIVER_I/P (in), RDP (out), 0 (out), 9 (out), 8 (out), 7 (out), 6 (out), 5 (out), 4 (out), 3 (out), 2 (out), 1 (out), LDP (out), TUBE_LED_SWITCH (in)

### Ports
0 (out), 1 (out), 2 (out), 3 (out), 4 (out), 5 (out), 6 (out), 7 (out), 8 (out), 9 (out), ANODE_DRIVER_I/P_0 (in), ANODE_DRIVER_I/P_1 (in), TUBE_LED_SWITCH (in)

### Nets
0: port 0, sheet IN-14 VALVE_0/0, sheet IN-14 VALVE_1/0
1: port 1, sheet IN-14 VALVE_0/1, sheet IN-14 VALVE_1/1
2: port 2, sheet IN-14 VALVE_0/2, sheet IN-14 VALVE_1/2
3: port 3, sheet IN-14 VALVE_0/3, sheet IN-14 VALVE_1/3
4: port 4, sheet IN-14 VALVE_0/4, sheet IN-14 VALVE_1/4
5: port 5, sheet IN-14 VALVE_0/5, sheet IN-14 VALVE_1/5
6: port 6, sheet IN-14 VALVE_0/6, sheet IN-14 VALVE_1/6
7: port 7, sheet IN-14 VALVE_0/7, sheet IN-14 VALVE_1/7
8: port 8, sheet IN-14 VALVE_0/8, sheet IN-14 VALVE_1/8
9: port 9, sheet IN-14 VALVE_0/9, sheet IN-14 VALVE_1/9
ANODE_DRIVER_I/P_0: port ANODE_DRIVER_I/P_0, sheet IN-14 VALVE_0/ANODE_DRIVER_I/P
ANODE_DRIVER_I/P_1: port ANODE_DRIVER_I/P_1, sheet IN-14 VALVE_1/ANODE_DRIVER_I/P
TUBE_LED_SWITCH: port TUBE_LED_SWITCH, sheet IN-14 VALVE_0/TUBE_LED_SWITCH, sheet IN-14 VALVE_1/TUBE_LED_SWITCH

### Channels
VALVES/IN-14_VALVE_x2_0: ports 0=C_0 1=C_1 2=C_2 3=C_3 4=C_4 5=C_5 6=C_6 7=C_7 8=C_8 9=C_9 ANODE_DRIVER_I/P_0=ANODE_DRIVER_0 ANODE_DRIVER_I/P_1=ANODE_DRIVER_1 TUBE_LED_SWITCH=T_L_SW_0
VALVES/IN-14_VALVE_x2_1: ports 0=C_0 1=C_1 2=C_2 3=C_3 4=C_4 5=C_5 6=C_6 7=C_7 8=C_8 9=C_9 ANODE_DRIVER_I/P_0=ANODE_DRIVER_2 ANODE_DRIVER_I/P_1=ANODE_DRIVER_3 TUBE_LED_SWITCH=T_L_SW_1
VALVES/IN-14_VALVE_x2_2: ports 0=C_0 1=C_1 2=C_2 3=C_3 4=C_4 5=C_5 6=C_6 7=C_7 8=C_8 9=C_9 ANODE_DRIVER_I/P_0=ANODE_DRIVER_4 ANODE_DRIVER_I/P_1=ANODE_DRIVER_5 TUBE_LED_SWITCH=T_L_SW_2

### Notes on the sheet
- Project:
- Designer:
- Sheet
- of
- Filename:

### Library data of the parts
? = CMP-00003-4: The KETS Schematic Sheet Title Block

## Sheet IN-14 VALVE.SchDoc
size A4; SheetNumber: 5; SheetTotal: 9
Used 6 times, as channels VALVES/IN-14_VALVE_x2_0/IN-14 VALVE_0, VALVES/IN-14_VALVE_x2_0/IN-14 VALVE_1, VALVES/IN-14_VALVE_x2_1/IN-14 VALVE_0, VALVES/IN-14_VALVE_x2_1/IN-14 VALVE_1, VALVES/IN-14_VALVE_x2_2/IN-14 VALVE_0, VALVES/IN-14_VALVE_x2_2/IN-14 VALVE_1. Parts and nets are listed once, with the designators drawn on the sheet.
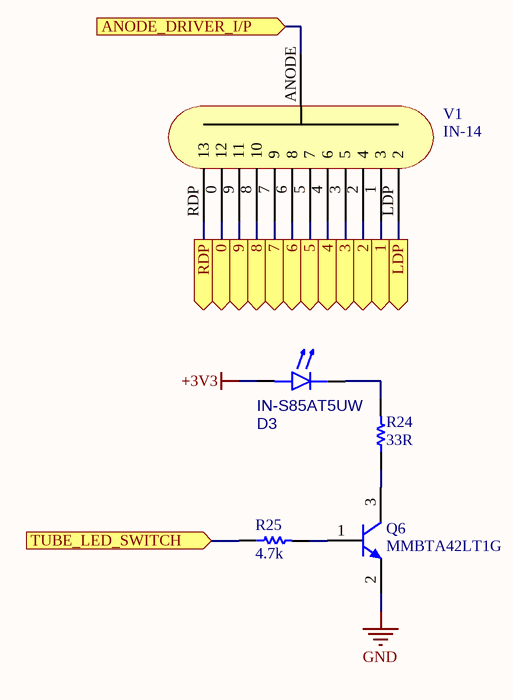
[diagram p6: IN-14 VALVE.SchDoc]

### Parts
?  (no value)
D3  IN-S85AT5UW  [DIOC2012X11N]
Q6  MMBTA42LT1G  [ONSC-SOT-23-3-318-08_V]
R24  value 33R  [RESC1608X55X25NL10T15]  (hidden comment: ERJ-3EKF33R0V)
R25  value 4.7k  [RESC1608X55X25NL10T15]  (hidden comment: Resistor 4k7 +/-1% 0603 100 mW)
V1  IN-14  [Nixie IN-14 Valve]

### Ports
0 (out), 1 (out), 2 (out), 3 (out), 4 (out), 5 (out), 6 (out), 7 (out), 8 (out), 9 (out), ANODE_DRIVER_I/P (in), LDP (out), RDP (out), TUBE_LED_SWITCH (in)

### Nets
+3V3: D3.2(A)
GND: Q6.2(E)
0: V1.0(12) ; port 0
1: V1.1(3) ; port 1
2: V1.2(4) ; port 2
3: V1.3(5) ; port 3
4: V1.4(6) ; port 4
5: V1.5(7) ; port 5
6: V1.6(8) ; port 6
7: V1.7(9) ; port 7
8: V1.8(10) ; port 8
9: V1.9(11) ; port 9
ANODE_DRIVER_I/P: V1.ANODE ; port ANODE_DRIVER_I/P
LDP: V1.LDP(2) ; port LDP
RDP: V1.RDP(13) ; port RDP
TUBE_LED_SWITCH: R25.1 ; port TUBE_LED_SWITCH
NetD3_1: D3.1(K) R24.2
NetQ6_1: Q6.1(B) R25.2
NetQ6_3: Q6.3(C) R24.1

### Channels
VALVES/IN-14_VALVE_x2_0/IN-14 VALVE_0: designators end in A; ports 0=C_0 1=C_1 2=C_2 3=C_3 4=C_4 5=C_5 6=C_6 7=C_7 8=C_8 9=C_9 ANODE_DRIVER_I/P=ANODE_DRIVER_0 LDP=LDP_IN-14 VALVE_0 RDP=RDP_IN-14 VALVE_0 TUBE_LED_SWITCH=T_L_SW_0
VALVES/IN-14_VALVE_x2_0/IN-14 VALVE_1: designators end in B; ports 0=C_0 1=C_1 2=C_2 3=C_3 4=C_4 5=C_5 6=C_6 7=C_7 8=C_8 9=C_9 ANODE_DRIVER_I/P=ANODE_DRIVER_1 LDP=LDP_IN-14 VALVE_1 RDP=RDP_IN-14 VALVE_1 TUBE_LED_SWITCH=T_L_SW_0
VALVES/IN-14_VALVE_x2_1/IN-14 VALVE_0: designators end in C; ports 0=C_0 1=C_1 2=C_2 3=C_3 4=C_4 5=C_5 6=C_6 7=C_7 8=C_8 9=C_9 ANODE_DRIVER_I/P=ANODE_DRIVER_2 LDP=LDP_IN-14 VALVE_0 RDP=RDP_IN-14 VALVE_0 TUBE_LED_SWITCH=T_L_SW_1
VALVES/IN-14_VALVE_x2_1/IN-14 VALVE_1: designators end in D; ports 0=C_0 1=C_1 2=C_2 3=C_3 4=C_4 5=C_5 6=C_6 7=C_7 8=C_8 9=C_9 ANODE_DRIVER_I/P=ANODE_DRIVER_3 LDP=LDP_IN-14 VALVE_1 RDP=RDP_IN-14 VALVE_1 TUBE_LED_SWITCH=T_L_SW_1
VALVES/IN-14_VALVE_x2_2/IN-14 VALVE_0: designators end in E; ports 0=C_0 1=C_1 2=C_2 3=C_3 4=C_4 5=C_5 6=C_6 7=C_7 8=C_8 9=C_9 ANODE_DRIVER_I/P=ANODE_DRIVER_4 LDP=LDP_IN-14 VALVE_0 RDP=RDP_IN-14 VALVE_0 TUBE_LED_SWITCH=T_L_SW_2
VALVES/IN-14_VALVE_x2_2/IN-14 VALVE_1: designators end in F; ports 0=C_0 1=C_1 2=C_2 3=C_3 4=C_4 5=C_5 6=C_6 7=C_7 8=C_8 9=C_9 ANODE_DRIVER_I/P=ANODE_DRIVER_5 LDP=LDP_IN-14 VALVE_1 RDP=RDP_IN-14 VALVE_1 TUBE_LED_SWITCH=T_L_SW_2

### Notes on the sheet
- Project:
- Designer:
- Sheet
- of
- Filename:

### Library data of the parts
? = CMP-00003-4: The KETS Schematic Sheet Title Block
D3 = CMP-007-00039-1: SMD LED - Mono Color Top View, 805 1.1mm LED PCB Type, White, High Brightness, Clear Lens, Angle 120; Reverse Voltage: 5V; Nominal Vf: 3.4V; Number of Circuits: 1; Luminous Intensity: 285mcd; Forward Voltage: 2.8V; Forward Current: 25mA; Shape: Rectangular; Viewing Angle: 120°; RoHS Compliant: Yes; Height: 1.1mm; Terminal Pitch: 1.6mm; Number of Terminals: 2; Min Operating Temperature: -30°C; Pins: 2; Colour: White; Max Operating Temperature: 85°C; Color: White; Case/Package: 0805; Mounting Technology: Surface Mount; RoHS: Non-Compliant; Lens Style: Clear; Schedule B: 8541402000
Q6 = CMP-013-00062-1: as Q1 on sheet MCU; Clock Frequency: 50MHz; Element Configuration: Single; Packaging: Tape and Reel; Lead Free: Lead Free; RoHS: Compliant; Number of Terminals: 3; Lifecycle Status: Production; Current Rating: 500mA; Polarity: NPN; Width: 1.397mm; Case/Package: SOT-23-3; Max Operating Temperature: 150°C; China RoHS: Compliant; Height: 1.016mm; Weight: 4.535924g; Gain Bandwidth Product: 50MHz; Contact Plating: Tin; Schedule B: 8541210080, 8541210080; Pins: 3; Transition Frequency: 50MHz; Voltage Rating (DC): 300V; REACH SVHC: Yes; Collector Emitter Voltage (VCEO): 300V; Min Operating Temperature: -55°C; Collector Base Voltage (VCBO): 300V; Length: 3.0226mm; Max Breakdown Voltage: 300V; Radiation Hardening: No
R24 = CMP-00050-3: Fixed Resistor, Metal Glaze/thick Film, 0.1W, 33ohm, 75V, 1% +/-Tol, 100ppm/Cel, Surface Mount, 0603; Package Width: 0.8mm; Package Height: 0.45mm; Rated Temperature: 70°C; Power: 100mW; Reference Standard: AEC-Q200; Package Length: 1.6mm; Temperature Coefficient: 100ppm/°C; Max Operating Temperature: 155°C; Working Voltage: 75V; Resistor Type: FIXED RESISTOR; JESD-609 Code: e3; Technology: METAL GLAZE/THICK FILM; Tolerance: 1%; Reach SVHC Compliant: Yes; Packaging: Tape and Reel; Terminal Finish: Nickel; Case/Package: 0603; Package Shape: Rectangular; Mounting Technology: Surface Mount; Min Operating Temperature: -55°C; RoHS Compliant: Yes; Termination: Wraparound; Construction: Rectangular; Pins: 2; Package Style: SMTMeter
R25 = CMP-009-00031-13: as R1 on sheet MCU; RoHS Compliant: True; Min Operating Temperature: -55°C; Tolerance: 1%; Mounting Technology: SM; Max Operating Temperature: 155°C; Pins: 2; Case/Package: 0603
V1 = CMP-00026-00006-13: IN-14 Cold Cathode Valve; Mounting Technology: THT; Case/Package: IN-14; Pins: 13

## Sheet IN-3 VALVE.SchDoc
size A4; SheetNumber: 8; SheetTotal: 9
Used 2 times, as channels VALVES/IN-3 VALVE_0, VALVES/IN-3 VALVE_1. Parts and nets are listed once, with the designators drawn on the sheet.
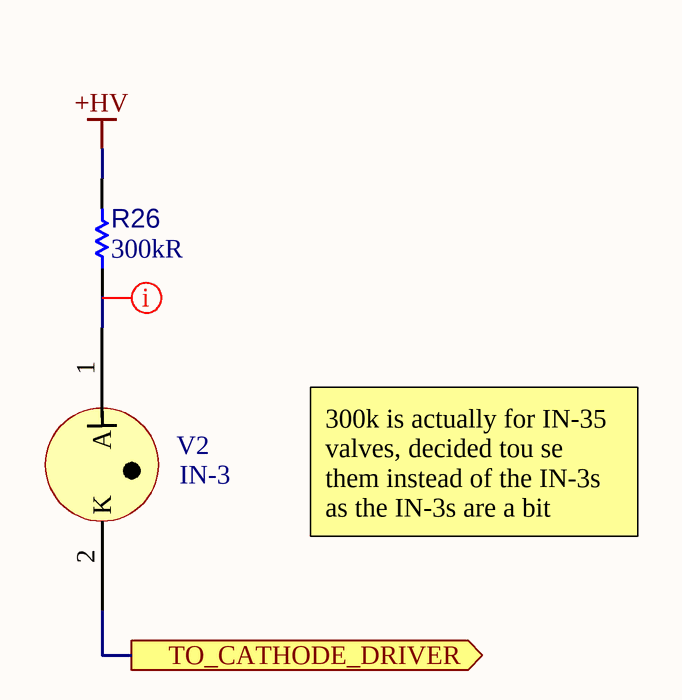
[diagram p7: IN-3 VALVE.SchDoc]

### Parts
?  (no value)
R26  value 300kR  [RESC3126X65X50NL10T20]  (hidden comment: SG73P2ETTD3003F)
V2  IN-3  [IN-3-Footprint-1]

### Ports
TO_CATHODE_DRIVER (out)

### Nets
+HV: R26.2
TO_CATHODE_DRIVER: V2.2(K) ; port TO_CATHODE_DRIVER
NetR26_1: R26.1 V2.1(A)

### Channels
VALVES/IN-3 VALVE_0: designators end in A; ports TO_CATHODE_DRIVER=IN-3_CATHODE_0
VALVES/IN-3 VALVE_1: designators end in B; ports TO_CATHODE_DRIVER=IN-3_CATHODE_1

### Layout directives
net class HIGH VOLTAGE: NetR26A_1

### Notes on the sheet
- 300k is actually for IN-35 valves, decided tou se them instead of the IN-3s as the IN-3s are a bit ugly(!)
- Project:
- Designer:
- Sheet
- of
- Filename:

### Library data of the parts
? = CMP-00003-4: The KETS Schematic Sheet Title Block
R26 = CMP-00405-2: Fixed Resistor, Metal Glaze/thick Film, 1.5W, 300000ohm, 200V, 1% +/-Tol, 200ppm/Cel, Surface Mount, 1210; Power Rating: 500mW; Temperature Coefficient: 200ppm/°C; RoHS: Compliant; Working Voltage: 200V; Case/Package: 1210; Lifecycle Status: Production; Max Operating Temperature: 155°C; Tolerance: 1%; Min Operating Temperature: -55°C; Pins: 2; Termination: SMD/SMT; Power Dissipation: 500mW; Case Code (Metric): 3225; Voltage Rating: 200V; Width: 2.6mm; Power: 1.5W; China RoHS: Non-Compliant; REACH SVHC: Yes; Mounting Technology: Surface Mount; Voltage Rating (DC): 200V; Height: 600µm; Case Code (Imperial): 1210; Number of Terminals: 2
V2 = CMP-00026-00007-7: IN-3 Cold Cathode Indicator Valve; Pins: 2; RoHS Compliant: Yes; Mounting Technology: THT

## Sheet IN-3 VALVE CATHODE DRIVER.SchDoc
size A4; SheetNumber: 9; SheetTotal: 9
Used 2 times, as channels VALVES/IN-3 VALVE CATHODE DRIVER0, VALVES/IN-3 VALVE CATHODE DRIVER1. Parts and nets are listed once, with the designators drawn on the sheet.
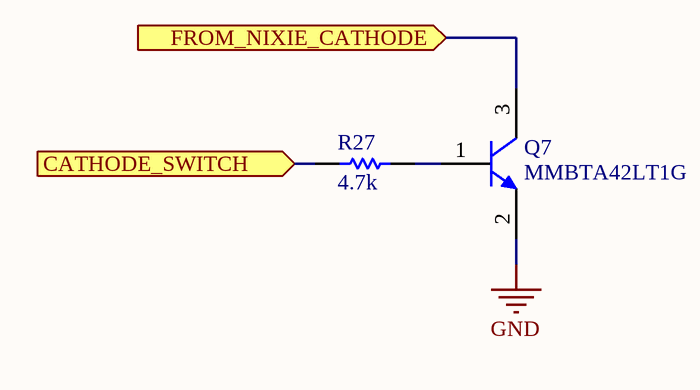
[diagram p8: IN-3 VALVE CATHODE DRIVER.SchDoc]

### Parts
?  (no value)
Q7  MMBTA42LT1G  [ONSC-SOT-23-3-318-08_V]
R27  value 4.7k  [RESC1608X55X25NL10T15]  (hidden comment: Resistor 4k7 +/-1% 0603 100 mW)

### Ports
CATHODE_SWITCH (in), FROM_NIXIE_CATHODE (in)

### Nets
GND: Q7.2(E)
CATHODE_SWITCH: R27.1 ; port CATHODE_SWITCH
FROM_NIXIE_CATHODE: Q7.3(C) ; port FROM_NIXIE_CATHODE
NetQ7_1: Q7.1(B) R27.2

### Channels
VALVES/IN-3 VALVE CATHODE DRIVER0: designators end in A; ports CATHODE_SWITCH=IN-3_SW_0 FROM_NIXIE_CATHODE=IN-3_CATHODE_0
VALVES/IN-3 VALVE CATHODE DRIVER1: designators end in B; ports CATHODE_SWITCH=IN-3_SW_1 FROM_NIXIE_CATHODE=IN-3_CATHODE_1

### Notes on the sheet
- Project:
- Designer:
- Sheet
- of
- Filename:

### Library data of the parts
? = CMP-00003-4: The KETS Schematic Sheet Title Block
Q7 = CMP-013-00062-1: as Q1 on sheet MCU; Clock Frequency: 50MHz; Element Configuration: Single; Packaging: Tape and Reel; Lead Free: Lead Free; RoHS: Compliant; Number of Terminals: 3; Lifecycle Status: Production; Current Rating: 500mA; Polarity: NPN; Width: 1.397mm; Case/Package: SOT-23-3; Max Operating Temperature: 150°C; China RoHS: Compliant; Height: 1.016mm; Weight: 4.535924g; Gain Bandwidth Product: 50MHz; Contact Plating: Tin; Schedule B: 8541210080, 8541210080; Pins: 3; Transition Frequency: 50MHz; Voltage Rating (DC): 300V; REACH SVHC: Yes; Collector Emitter Voltage (VCEO): 300V; Min Operating Temperature: -55°C; Collector Base Voltage (VCBO): 300V; Length: 3.0226mm; Max Breakdown Voltage: 300V; Radiation Hardening: No
R27 = CMP-009-00031-13: as R1 on sheet MCU; RoHS Compliant: True; Min Operating Temperature: -55°C; Tolerance: 1%; Mounting Technology: SM; Max Operating Temperature: 155°C; Pins: 2; Case/Package: 0603